# EAGLE design Brickster 8884bt Receiver (EAGLE 6.5.0)
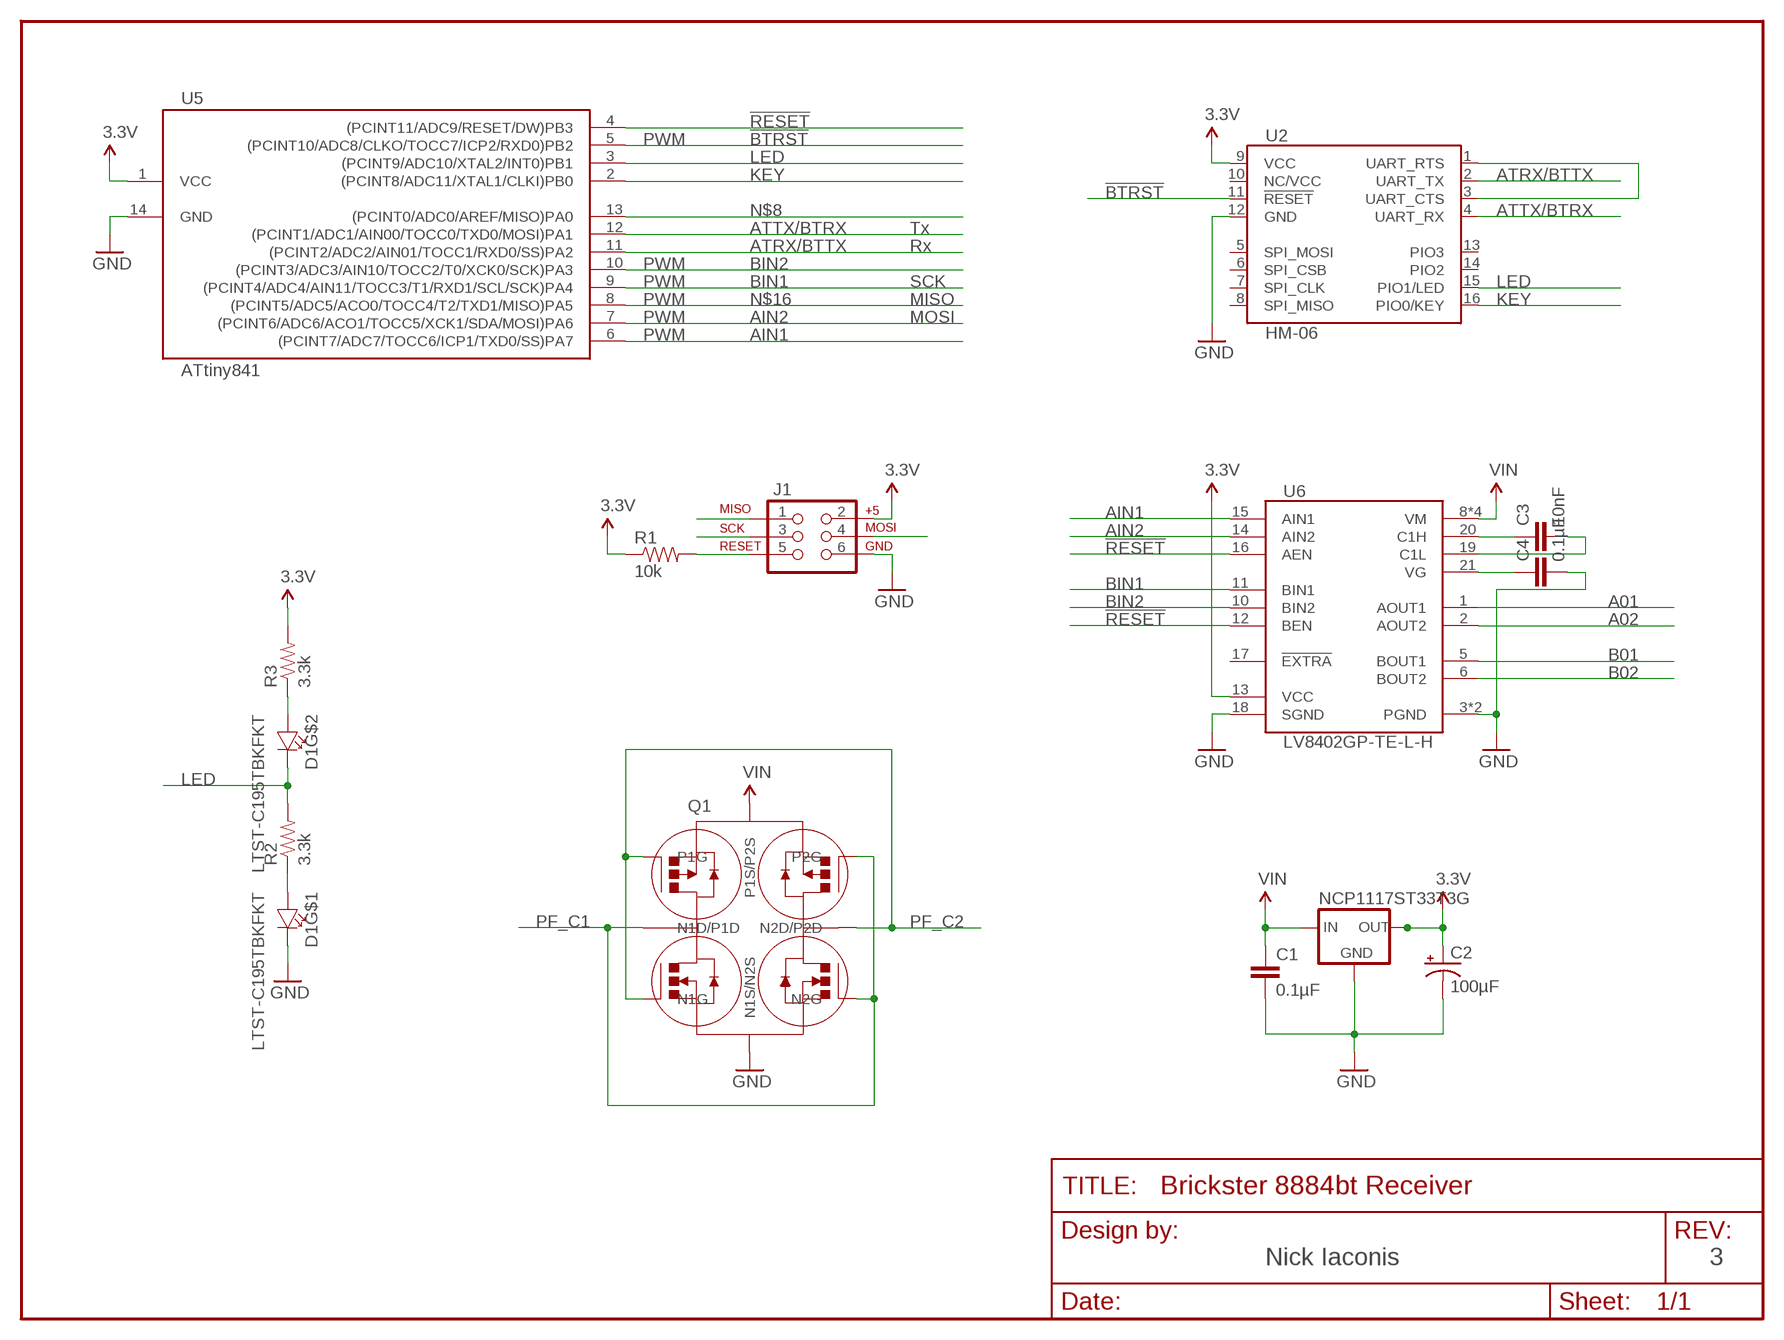
[diagram p0: schematic, sheet 1]

## Parts
C1  0.1µF  C0402  [0402]
C2  100µF  C_POL  [1206]
C3  10nF  C0402  [0402]
C4  0.1µF  C0402  [0402]
D1  LTST-C195TBKFKT  LED_LTST_C195TBKFKT  [CHIP-LTST]
J1  AVR_SPI_PRG_6NS  [2X3-NS]
NCP1117ST33T3G  IC_RT9164A  [SOT223]
Q1  DMHC3025LSD-13  IC_FET_BRIDGESO8  [SO8]
R1  10k  R0402  [0402]
R2  3.3k  R0402  [0402]
R3  3.3k  R0402  [0402]
U2  HM-06  HM-05/06/07HM-05/06/07  [HM-05/06/07]
U5  ATtiny841  ATTINY441/841-SSU  [14SOICN]
U6  LV8402GP-TE-L-H  LV8402GPLV8402GP  [VCT24]

## Nets
3.3V: C2.1(+) J1.2 NCP1117ST33T3G.2(OUT) NCP1117ST33T3G.4 R1.1 R3.2 U2.9(VCC) U5.1(VCC) U6.13(VCC)
!BTRST: U2.11(!RESET) U5.5((PCINT10/ADC8/CLKO/TOCC7/ICP2/RXD0)PB2)
!RESET: J1.5 R1.2 U5.4((PCINT11/ADC9/RESET/DW)PB3) U6.12(BEN) U6.16(AEN)
A01: U6.1(AOUT1)
A02: U6.2(AOUT2)
AIN1: U5.6((PCINT7/ADC7/TOCC6/ICP1/TXD0/SS)PA7) U6.15(AIN1)
AIN2: J1.4 U5.7((PCINT6/ADC6/ACO1/TOCC5/XCK1/SDA/MOSI)PA6) U6.14(AIN2)
ATRX/BTTX: U2.2(UART_TX) U5.11((PCINT2/ADC2/AIN01/TOCC1/RXD0/SS)PA2)
ATTX/BTRX: U2.4(UART_RX) U5.12((PCINT1/ADC1/AIN00/TOCC0/TXD0/MOSI)PA1)
B01: U6.5(BOUT1)
B02: U6.6(BOUT2)
BIN1: J1.3 U5.9((PCINT4/ADC4/AIN11/TOCC3/T1/RXD1/SCL/SCK)PA4) U6.11(BIN1)
BIN2: U5.10((PCINT3/ADC3/AIN10/TOCC2/T0/XCK0/SCK)PA3) U6.10(BIN2)
GND: C1.2 C2.2(-) C4.2 D1.3 J1.6 NCP1117ST33T3G.1(GND) Q1.P$3(N1S/N2S) U2.12(GND) U5.14(GND) U6.3(PGND) U6.4(PGND) U6.18(SGND)
KEY: U2.16(PIO0/KEY) U5.2((PCINT8/ADC11/XTAL1/CLKI)PB0)
LED: D1.4 R2.2 U2.15(PIO1/LED) U5.3((PCINT9/ADC10/XTAL2/INT0)PB1)
N$1: D1.2 R3.1
N$2: D1.1 R2.1
N$3: U2.1(UART_RTS) U2.3(UART_CTS)
N$8: U5.13((PCINT0/ADC0/AREF/MISO)PA0)
N$10: C3.2 U6.19(C1L)
N$11: C4.1 U6.21(VG)
N$15: C3.1 U6.20(C1H)
N$16: J1.1 U5.8((PCINT5/ADC5/ACO0/TOCC4/T2/TXD1/MISO)PA5)
PF_C1: Q1.P$2(N1D/P1D) Q1.P$4(N2G) Q1.P$5(P2G)
PF_C2: Q1.P$1(N1G) Q1.P$6(N2D/P2D) Q1.P$8(P1G)
VIN: C1.1 NCP1117ST33T3G.3(IN) Q1.P$7(P1S/P2S) U6.8(VM) U6.9(VM) U6.22(VM) U6.23(VM)
Unconnected: U2.5(SPI_MOSI) U2.6(SPI_CSB) U2.7(SPI_CLK) U2.8(SPI_MISO) U2.10(NC/VCC) U2.13(PIO3) U2.14(PIO2) U6.17(!EXTRA)

## Notes on the sheet
- PWM
- Tx
- Rx
- PWM
- PWM | SCK
- PWM | MISO
- PWM | MOSI
- PWM
- Nick Iaconis | 3

## Library data of the parts
C1 C3 C4 = brickster:C
C2 = brickster:C_POL
D1 = brickster:LED_LTST_C195TBKFKT
J1 = SparkFun-Connectors:AVR_SPI_PRG_6: AVR ISP 6 Pin This is the reduced ISP connector for AVR programming. Common on Arduino. This footprint will take up less PCB space and can be used with a 10-pin to 6-pin adapter such as SKU: BOB-08508
NCP1117ST33T3G = brickster:IC_RT9164A
Q1 = brickster:IC_FET_BRIDGE
R1-R3 = brickster:R; PARTNO: ERJ-3GEYJ103V
U2 = codefox421-parts:HM-05/06/07: HM-05, HM-06, HM-07 Bluetooth transceiver Source: http://www.jnhuamao.cn/bluetooth.asp
U5 = bt_avr:ATTINY441/841: ATtiny441, ATtiny841 AVR Microcontroller The high-performance Atmel picoPower 8-bit AVR RISC-based microcontroller combines 4KB ISP flash memory, 512-Byte EEPROM, 128B SRAM, 12 general purpose I/O lines, 32 general purpose working registers, an 8-bit timer/counter with two PWM channels, two 16-bit timer/counters with two PWM channels, internal and external interrupts, an 12-channel 10-bit A/D converter, 2 On-chip analog comparators, 2 full duplex USARTs with Start Frame wake up from power down, master/slave SPI serial interface, slave I2C serial interface, programmable gain stage (1x, 20x, and 100x) for 12 differential ADC channel pairs, programmable watchdog timer with internal oscillator, internal calibrated oscillator, and four software selectable power saving modes. The device operates between 1.7-5.5 volts. datasheet.pdf <http://www.atmel.com/Images/Atmel-8495-8-bit-AVR-Microcontrollers-ATtiny441-ATtiny841_Datasheet.pdf>
U6 = codefox421-parts:LV8402GP

## Board
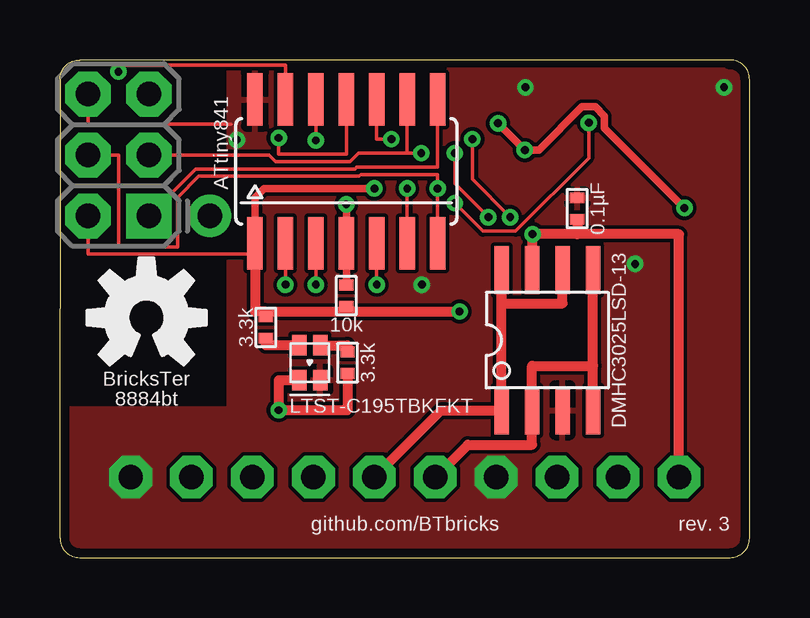
[diagram p1: board, top side]
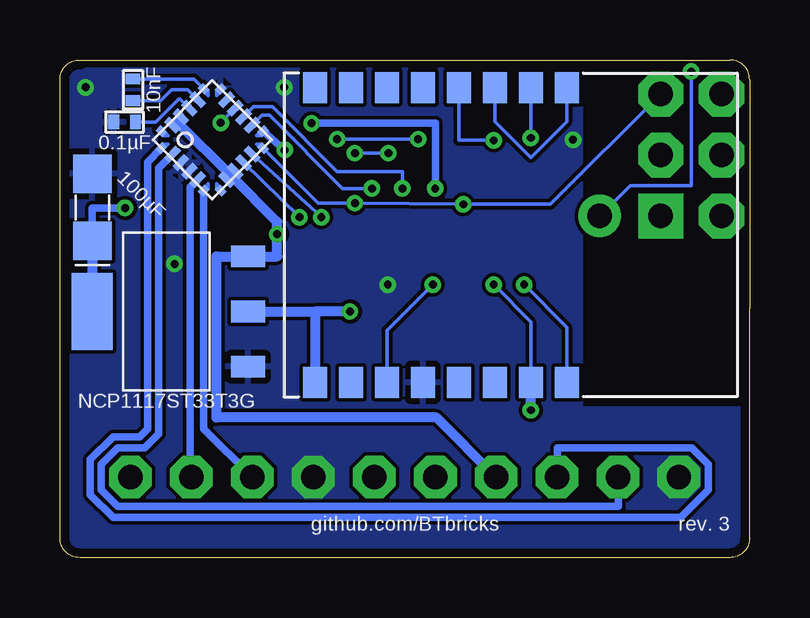
[diagram p2: board, bottom side, seen from below]

Size 28.75 x 20.75 mm. Coordinates in mm from the lower left corner, seen from the top.
Outline: 27.94,20.75 arc-90 28.75,19.94 28.75,0.81 arc-90 27.94,0 0.81,0 arc-90 0,0.81 0,10.39
Copper layers (1*16): Top 0.0356mm / dielectric 1.5011mm / Bottom 0.0356mm
Design rules "LaenPCBOrder *": minimum track width 6mil, minimum drill 13mil, track to track 6mil, track to pad 6mil, pad to pad 6mil, via to via 6mil, smd to smd 6mil, copper to edge 15mil, drill to drill 6mil, minimum pad ring 7mil, minimum via ring 7mil, stop-mask expansion 2mil, vias tented up to drill 13mil, thermal gap 10mil
Milling: 3 lines

### Footprints (pad centres in the part's own frame; a part is rotated, then mirrored left to right if it is on the bottom)
0402 = smd 0.45 x 0.6: 1 -0.45,0; 2 0.45,0
1206 = smd 1.6 x 1.6: 1 -1.4,0; 2 1.4,0
CHIP-LTST = smd 0.6 x 0.85: 1 0.44,0.725; 2 -0.44,0.725; 3 0.44,-0.725; 4 -0.44,-0.725
2X3-NS = drill 1.016 pad 1.88 square: 1 -2.54,-1.27 | drill 1.016 pad 1.88 octagon: 2 -2.54,1.27; 3 0,-1.27; 4 0,1.27; 5 2.54,-1.27; 6 2.54,1.27
SOT223 = smd 0.9 x 1.4: 1 -2.3,-3.4; 2 0,-3.4; 3 2.3,-3.4 | smd 3.2 x 1.7: 4 0,3.1
SO8 = smd 0.6 x 2: P$1 -1.905,-2.925; P$2 -0.635,-2.925; P$3 0.635,-2.925; P$4 1.905,-2.925; P$5 1.905,2.925; P$6 0.635,2.925; P$7 -0.635,2.925; P$8 -1.905,2.925
HM-05/06/07 = smd 1.3 x 1: 1 -6.15,0; 2 -6.15,-1.5; 3 -6.15,-3; 4 -6.15,-4.5; 5 -6.15,-6; 6 -6.15,-7.5; 7 -6.15,-9; 8 -6.15,-10.5; 9 6.15,-10.5; 10 6.15,-9; 11 6.15,-7.5; 12 6.15,-6; 13 6.15,-4.5; 14 6.15,-3; 15 6.15,-1.5; 16 6.15,0
14SOICN = smd 0.66 x 2.2: 1 -3.81,-3; 2 -2.54,-3; 3 -1.27,-3; 4 0,-3; 5 1.27,-3; 6 2.54,-3; 7 3.81,-3; 8 3.81,3; 9 2.54,3; 10 1.27,3; 11 0,3; 12 -1.27,3; 13 -2.54,3; 14 -3.81,3
VCT24 = smd 0.4 x 0.3: 1 -1.75,1.25; 6 -1.75,-1.25; 13 1.75,-1.25; 18 1.75,1.25 | smd 0.7 x 0.3: 2 -1.6,0.75; 3 -1.6,0.25; 4 -1.6,-0.25; 5 -1.6,-0.75; 14 1.6,-0.75; 15 1.6,-0.25; 16 1.6,0.25; 17 1.6,0.75 | smd 0.3 x 0.4: 7 -1.25,-1.75; 12 1.25,-1.75; 19 1.25,1.75; 24 -1.25,1.75 | smd 0.3 x 0.7: 8 -0.75,-1.6; 9 -0.25,-1.6; 10 0.25,-1.6; 11 0.75,-1.6; 20 0.75,1.6; 21 0.25,1.6; 22 -0.25,1.6; 23 -0.75,1.6

### Placement (x,y rotation side)
C1  21.56,14.55 90 top
C2  27.41,14.61 90 bottom
C3  25.7,19.51 90 bottom
C4  26.06,18.16 180 bottom
D1  10.41,8.13 0 top
J1  2.44,16.79 90 top
LOGO1  OSHW-LOGOM  [OSHW-LOGO-M]  3.61,10.01 0 top
NCP1117ST33T3G  24.31,10.26 90 bottom
Q1  20.32,9.07 0 top
R1  11.94,10.92 90 top
R2  11.99,8.13 270 top
R3  8.59,9.6 90 top
U2  7.62,13.45 270 bottom
U5  11.94,16.1 0 top
U6  22.4,17.42 45 bottom

### Tracks (layer width: path | path; a pad name or v marks a point on that pad's centre or on a via)
3.3V  (via drill 0.33)
  Top 0.152: J1.2 1.17,12.65 8.13,12.65
  Top 0.305: v18.26,18.11 v19.38,16.99 19.96,16.99 21.77,18.8 22.33,18.8 22.71,18.41 22.71,17.91 v26.04,14.58 | v13.11,15.39 8.51,15.39 8.13,15.01 U5.1
  Top 0.406: R1.1 11.94,10.26 | 11.94,10.26 v16.66,10.26 | U5.1 8.13,12.65 8.13,10.26 8.59,10.26 | 8.59,10.26 11.94,10.26 | R3.2 8.59,10.26
  Bottom 0.305: U6.13 v19.38,16.99 | v18.26,18.11 13.11,18.11 v13.11,15.39 | NCP1117ST33T3G.4 27.41,14.58 v26.04,14.58
  Bottom 0.406: NCP1117ST33T3G.2 18.12,10.26 | 18.12,10.26 U2.9 | v16.66,10.26 18.12,10.26 | C2.1 NCP1117ST33T3G.4
!BTRST  (via drill 0.33)
  Top 0.152: U5.5 v13.21,11.38
  Bottom 0.152: v13.21,11.38 15.12,9.47 U2.11
!RESET  (via drill 0.33)
  Top 0.152: v22.05,18.14 22.05,16.66 19,13.61 17.63,13.61 v16.46,14.78
  Top 0.305: R1.2 U5.4 v11.94,14.73
  Bottom 0.152: J1.5 8.31,14.73 v11.94,14.73 v16.46,14.78 17.99,14.78 U6.12 | U6.16 v22.05,18.14
A01  (via drill 1.02 pad 1.78)
  Bottom 0.305: U6.1 25.09,16.5 25.09,5.36 25.43,5.03 26.54,5.03 27.48,4.09 27.48,2.62 26.54,1.68 2.87,1.68 1.73,2.82 1.73,3.89 2.41,4.57 8.02,4.57 v8.02,3.35
A02  (via drill 1.02 pad 1.78)
  Bottom 0.305: U6.2 24.64,16.25 24.64,5.16 25.22,4.57 26.34,4.57 27.03,3.89 27.03,2.82 26.34,2.13 5.48,2.13 v5.48,3.35
AIN1  (via drill 0.33)
  Top 0.152: v14.48,15.39 U5.6
  Bottom 0.152: U6.15 20.68,18.8 19.89,18.8 17.2,16.1 14.48,16.1 v14.48,15.39
AIN2  (via drill 0.33)
  Top 0.152: J1.4 2.44,16.79 2.44,12.95 4.9,12.95 4.9,15.01 5.79,15.9 12.47,15.9 12.55,15.98 15.75,15.98 v15.75,15.39 U5.7
  Bottom 0.152: U6.14 20.33,18.44 20.02,18.44 16.97,15.39 v15.75,15.39
ATRX/BTTX  (via drill 0.33)
  Top 0.152: U5.11 11.94,16.82 9.12,16.82 v9.12,17.5
  Bottom 0.152: v9.12,17.5 U2.2
ATTX/BTRX  (via drill 0.33)
  Top 0.152: U5.12 v10.67,17.4
  Bottom 0.152: 12.12,18.34 U2.4 12.12,17.4 v10.67,17.4
B01  (via drill 1.02 pad 1.78)
  Bottom 0.305: v23.27,3.35 23.32,3.35 23.32,15.45 U6.5
B02  (via drill 1.02 pad 1.78)
  Bottom 0.305: v20.73,3.35 22.76,5.38 U6.6
BIN1  (via drill 0.33)
  Top 0.152: 14.48,16.87 U5.9 | 14.48,16.87 v15.06,16.87 | v16.46,16.87 16.46,15.6 v17.86,14.2 | 14.48,16.87 12.45,16.87 12.09,16.51 8.99,16.51 8.71,16.79 J1.3
  Bottom 0.152: v15.06,16.87 v16.46,16.87 | v17.86,14.2 U6.11
BIN2  (via drill 0.33)
  Top 0.152: U5.10 13.21,17.45 v13.82,17.45 | v17.2,17.45 17.2,15.77 v18.77,14.2
  Bottom 0.152: v13.82,17.45 v17.2,17.45 | v18.77,14.2 U6.10
GND  (via drill 0.33, 1.02 pad 1.78)
  Top 0.152: J1.6 1.17,18.09 7.14,18.09
  other vias: 18.19,3.35 2.95,3.35 7.37,17.42 19.41,19.61 15.09,11.38 23.98,12.24 27.69,19.61
  pour Bottom: 0.38,0.38 28.37,0.38 28.37,20.37 7.01,20.37 7.01,6.25 0.38,6.25
  pour Top: 0.38,0.38 28.37,0.38 28.37,20.37 7.01,20.37 7.01,6.25 0.38,6.25
KEY  (via drill 0.33)
  Top 0.152: U5.2 v9.4,11.38
  Bottom 0.152: v9.4,11.38 7.62,9.6 U2.16
LED  (via drill 0.33)
  Top 0.152: U5.3 v10.67,11.38
  Top 0.406: 9.12,7.4 v9.12,6.15 11.99,6.15 R2.2 | 9.12,7.41 9.12,7.4 | 9.12,7.4 D1.4
  Bottom 0.152: v10.67,11.38 9.12,9.83 U2.15
  Bottom 0.406: U2.15 9.12,6.17 v9.12,6.15
N$1
  Top 0.406: D1.2 8.59,8.85 R3.1
N$2
  Top 0.406: D1.1 11.99,8.85 R2.1
N$3
  Bottom 0.152: U2.1 7.62,18.19 9.12,16.69 10.62,18.19 U2.3
N$8  (via drill 0.33, 1.02 pad 1.78)
  Top 0.152: U5.13 9.4,20.52 2.44,20.52 v2.44,20.27
  Bottom 0.152: v2.44,20.27 2.44,15.52 4.98,15.52 v6.25,14.25
N$10
  Bottom 0.152: U6.19 23.17,19.96 C3.2
N$11
  Bottom 0.152: U6.21 23.75,19.13 23.8,19.13 24.77,18.16 C4.1
N$15
  Bottom 0.152: U6.20 23.43,19.51 24.11,19.51 24.55,19.06 C3.1
N$16
  Top 0.152: J1.1 5.66,16.2 12.29,16.2 12.37,16.28 15.75,16.28 U5.8
PF_C1  (via drill 1.02 pad 1.78)
  Top 0.406: v15.65,3.35 17,4.7 19.68,4.7 Q1.P$2 19.68,8 22.23,8 | Q1.P$4 22.23,8 | 22.23,8 Q1.P$5
PF_C2  (via drill 1.02 pad 1.78)
  Top 0.406: v13.1,3.35 15.88,6.13 Q1.P$1 Q1.P$8 18.41,10.6 20.95,10.6 Q1.P$6
VIN  (via drill 0.33, 1.02 pad 1.78)
  Top 0.406: Q1.P$7 v19.7,13.49 21.57,13.49 | v25.81,3.35 25.81,13.49 21.57,13.49 | C1.1 21.57,13.49
  Bottom 0.305: U6.9 U6.8 21.62,15.92 | U6.22 U6.23 23.84,18.14
  Bottom 0.406: 23.84,18.14 21.62,15.92 19.7,14 v19.7,13.49 19.7,12.56 NCP1117ST33T3G.3 22.23,12.56 22.23,5.84 13.06,5.84 v10.57,3.35

### Text on the board
tPlace: BricksTer / 8884bt | github.com/BTbricks | rev. 3
bPlace: rev. 3 | github.com/BTbricks